# Altium schematic sheet SaidasMotoresCC.SchDoc: CONTROLADORA AIRPOPCORN
size A3; DocumentNumber: 4; SheetNumber: 4; SheetTotal: 15
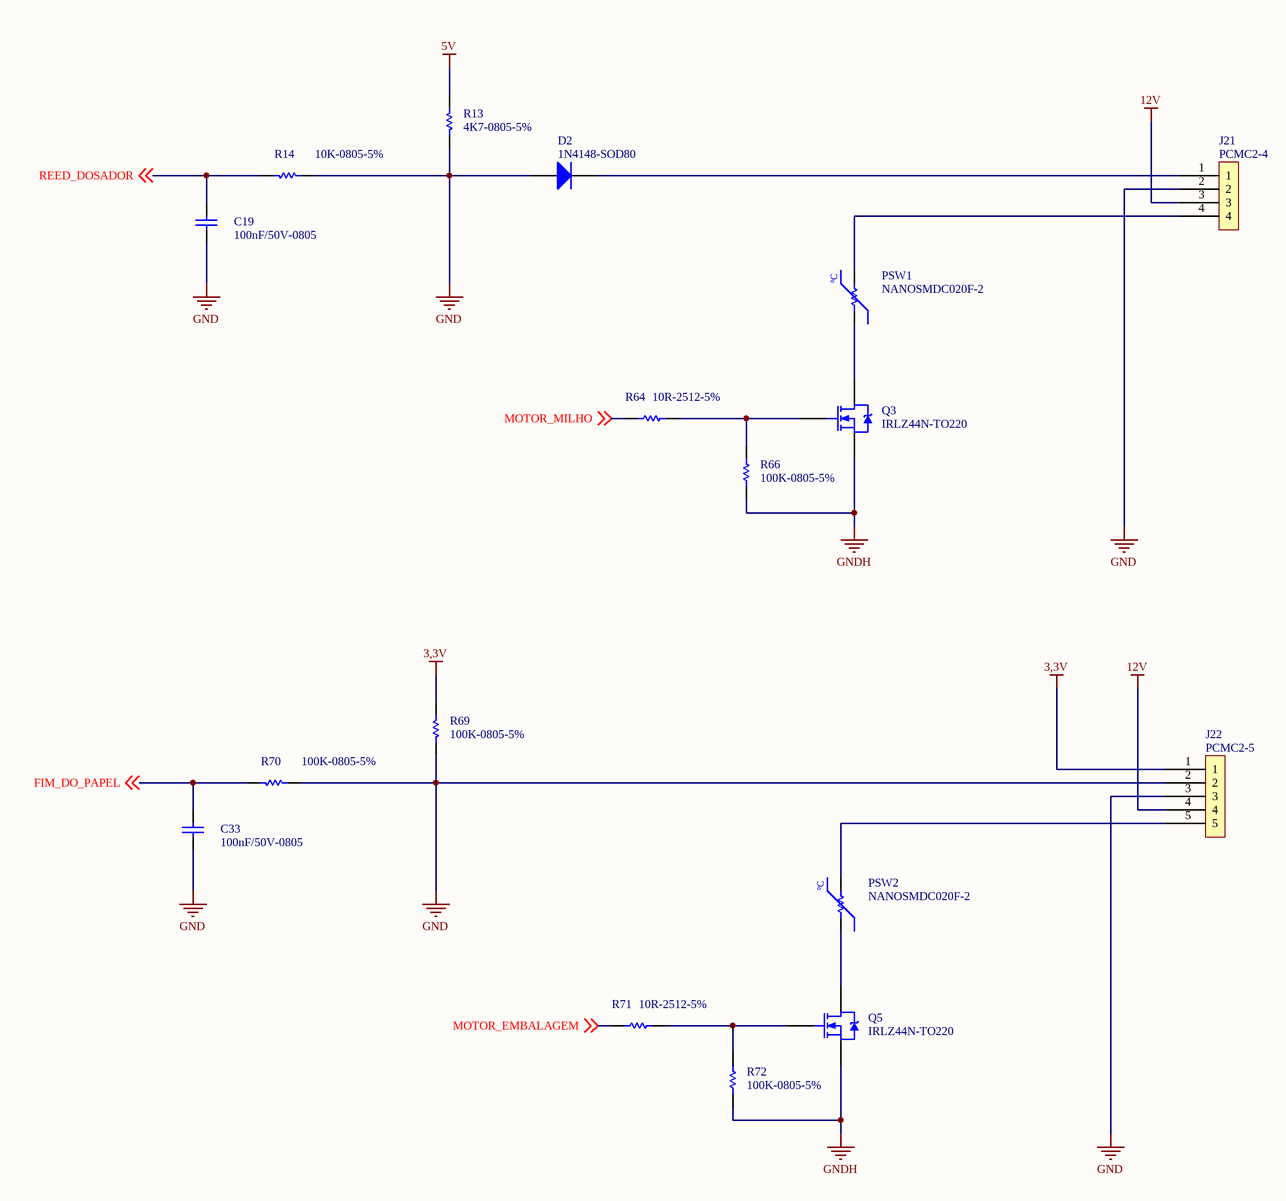
[diagram p0: SaidasMotoresCC.SchDoc]

## Parts
C19  100nF/50V-0805  [0805-REVISADO ONDA]
C33  100nF/50V-0805  [0805-REVISADO ONDA]
D2  1N4148-SOD80
J21  PCMC2-4  [PCMC2-4]
J22  PCMC2-5  [PCMC2-5]
PSW1  NANOSMDC020F-2  [2512 - REVISADO ONDA]
PSW2  NANOSMDC020F-2  [2512 - REVISADO ONDA]
Q3  IRLZ44N-TO220  [TO220-3 EM PÉ]
Q5  IRLZ44N-TO220  [TO220-3 EM PÉ]
R13  4K7-0805-5%  [0805-REVISADO ONDA]
R14  10K-0805-5%  [0805-REVISADO ONDA]
R64  10R-2512-5%  [1206-REVISADO ONDA]
R66  100K-0805-5%  [0805-REVISADO ONDA]
R69  100K-0805-5%  [0805-REVISADO ONDA]
R70  100K-0805-5%  [0805-REVISADO ONDA]
R71  10R-2512-5%  [1206-REVISADO ONDA]
R72  100K-0805-5%  [0805-REVISADO ONDA]

## Nets
3,3V: J22.1 R69.2
5V: R13.2
12V: J21.3 J22.4
GND: C19.1 C33.1 D2.1 J21.2 J22.2 J22.3 R13.1 R14.1 R69.1 R70.1
GNDH: Q3.3(S) Q5.3(S) R66.1 R72.1
FIM_DO_PAPEL: C33.2 R70.2 ; off-sheet FIM_DO_PAPEL
MOTOR_EMBALAGEM: R71.2 ; off-sheet MOTOR_EMBALAGEM
MOTOR_MILHO: R64.2 ; off-sheet MOTOR_MILHO
REED_DOSADOR: C19.2 R14.2 ; off-sheet REED_DOSADOR
NetD2_2: D2.2 J21.1
NetJ21_4: J21.4 PSW1.2
NetJ22_5: J22.5 PSW2.2
NetPSW1_1: PSW1.1 Q3.2(D)
NetPSW2_1: PSW2.1 Q5.2(D)
NetQ3_1: Q3.1(G) R64.1 R66.2
NetQ5_1: Q5.1(G) R71.1 R72.2

## Notes on the sheet
- NOME
- DATA
- PROJETO
- DESCRIÇÃO
- desenho
- verif.
- aprov.
- TAMANHO
- CODIGO
- Todas as informações disponíveis
- não devem ser divulgadas,
- em parte ou todo.
- CIRCUITO IMPRESSO
- MONTAGEM ELETRÔNICA
- A4
- de
- (in symbol POLYSWITCH 200mA) ºC

## Library data of the parts
C19 C33 = 100nF/50-0805-NPO: ERP: 104.11.005
PSW1 PSW2 = POLYSWITCH 200mA: ERP: 128.12.002
R13 R69 = 10K-0805-5%: ERP: 102.11.054
R14 R70 = 1K-0805-5%: ERP: 102.11.042
R64 R71 = 100K-0805-5%: ERP: 102.11.066
D2 = 1N4148-SOD80: ERP: 120.19.001
Q3 Q5 = IRLZ44N-TO220: ERP: 107.01.006
R66 R72 = 100K-0805-5%: ERP: 102.11.066